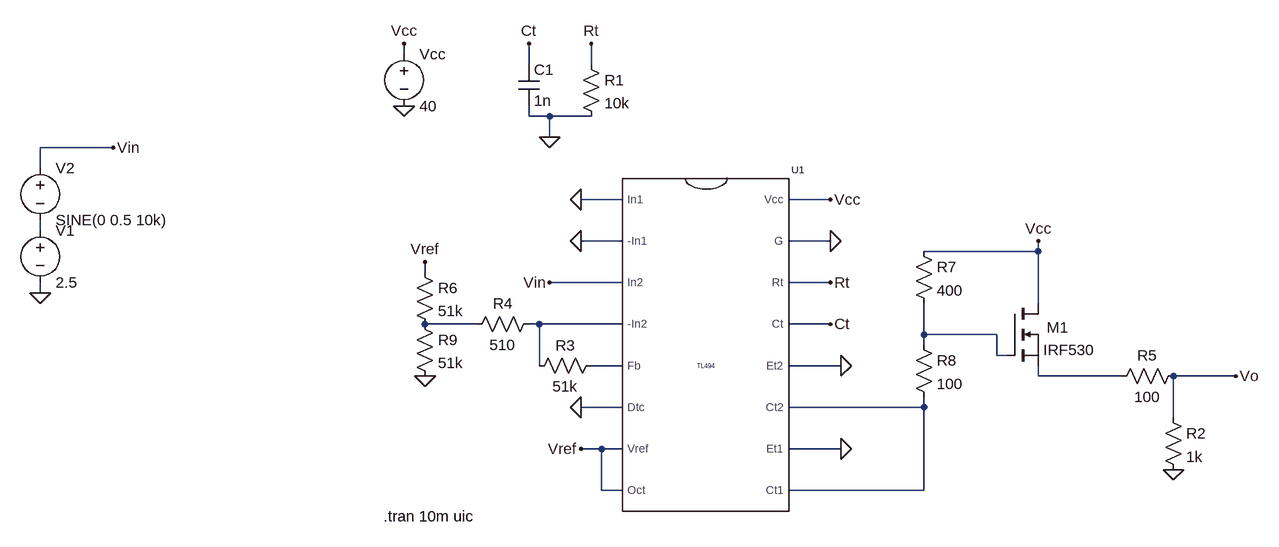
[diagram p0: schematic tl494 erik.asc]
tl494 erik.asc, the LTspice schematic file:
Version 4
SHEET 1 1120 680
WIRE -208 -240 -208 -256
WIRE -16 -224 -16 -256
WIRE 80 -224 80 -256
WIRE -16 -144 -16 -160
WIRE 16 -144 -16 -144
WIRE 80 -144 16 -144
WIRE 16 -112 16 -144
WIRE -656 -96 -768 -96
WIRE -768 -64 -768 -96
WIRE 128 -16 64 -16
WIRE 448 -16 384 -16
WIRE -768 32 -768 16
WIRE 128 48 64 48
WIRE 448 48 384 48
WIRE 768 64 768 48
WIRE 768 64 592 64
WIRE -176 96 -176 80
WIRE 128 112 16 112
WIRE 448 112 384 112
WIRE -768 128 -768 112
WIRE 768 144 768 64
WIRE -96 176 -176 176
WIRE 0 176 -16 176
WIRE 128 176 0 176
WIRE 448 176 384 176
WIRE 592 192 592 144
WIRE 704 192 592 192
WIRE 592 208 592 192
WIRE 704 224 704 192
WIRE 720 224 704 224
WIRE 0 240 0 176
WIRE 128 240 80 240
WIRE 464 240 384 240
WIRE 768 256 768 240
WIRE 896 256 768 256
WIRE 1072 256 976 256
WIRE 128 304 64 304
WIRE 592 304 592 288
WIRE 592 304 384 304
WIRE 976 320 976 256
WIRE 96 368 64 368
WIRE 128 368 96 368
WIRE 464 368 384 368
WIRE 96 432 96 368
WIRE 128 432 96 432
WIRE 592 432 592 304
WIRE 592 432 384 432
FLAG -208 -160 0
FLAG 448 -16 Vcc
FLAG 448 48 0
FLAG 16 -112 0
FLAG 448 112 Rt
FLAG 80 -256 Rt
FLAG -16 -256 Ct
FLAG 448 176 Ct
FLAG -208 -256 Vcc
FLAG 64 -16 0
FLAG 64 48 0
FLAG 64 304 0
FLAG 464 240 0
FLAG 464 368 0
FLAG 768 48 Vcc
FLAG 976 400 0
FLAG 1072 256 Vo
FLAG 64 368 Vref
FLAG -176 256 0
FLAG -176 80 Vref
FLAG 16 112 Vin
FLAG -768 128 0
FLAG -656 -96 Vin
SYMBOL tl494 256 240 R0
SYMATTR InstName U1
SYMBOL voltage -208 -256 R0
WINDOW 123 0 0 Left 0
WINDOW 39 0 0 Left 0
SYMATTR InstName Vcc
SYMATTR Value 40
SYMBOL cap -32 -224 R0
SYMATTR InstName C1
SYMATTR Value 1n
SYMBOL res 64 -240 R0
SYMATTR InstName R1
SYMATTR Value 10k
SYMBOL res 96 224 R90
WINDOW 0 0 56 VBottom 2
WINDOW 3 32 56 VTop 2
SYMATTR InstName R3
SYMATTR Value 51k
SYMBOL res 0 160 R90
WINDOW 0 0 56 VBottom 2
WINDOW 3 32 56 VTop 2
SYMATTR InstName R4
SYMATTR Value 510
SYMBOL res 992 240 R90
WINDOW 0 0 56 VBottom 2
WINDOW 3 32 56 VTop 2
SYMATTR InstName R5
SYMATTR Value 100
SYMBOL res 960 304 R0
SYMATTR InstName R2
SYMATTR Value 1k
SYMBOL res 576 48 R0
SYMATTR InstName R7
SYMATTR Value 400
SYMBOL res 576 192 R0
SYMATTR InstName R8
SYMATTR Value 100
SYMBOL nmos 720 144 R0
WINDOW 0 61 37 Left 2
SYMATTR InstName M1
SYMATTR Value IRF530
SYMBOL res -192 80 R0
SYMATTR InstName R6
SYMATTR Value 51k
SYMBOL res -192 160 R0
SYMATTR InstName R9
SYMATTR Value 51k
SYMBOL voltage -768 16 R0
WINDOW 123 0 0 Left 0
WINDOW 39 0 0 Left 0
SYMATTR InstName V1
SYMATTR Value 2.5
SYMBOL voltage -768 -80 R0
WINDOW 123 0 0 Left 0
WINDOW 39 0 0 Left 0
SYMATTR InstName V2
SYMATTR Value SINE(0 0.5 10k)
TEXT -240 472 Left 2 !.tran 10m uic

The netlist it stands for:
* tl494 erik.asc
XU1 0 0 Vin N003 N005 0 Vref Vref N007 0 N007 0 Ct Rt 0 Vcc TL494 TL494  ; pins In1 -In1 In2 -In2 Fb Dtc Vref Oct Ct1 Et1 Ct2 Et2 Ct Rt G Vcc
Vcc Vcc 0 40
C1 Ct 0 1n
R1 Rt 0 10k
R3 N005 N003 51k
R4 N003 N002 510
R5 Vo N006 100
R2 Vo 0 1k
R7 Vcc N004 400
R8 N004 N007 100
M1 Vcc N004 N006 N006 IRF530
R6 Vref N002 51k
R9 N002 0 51k
V1 N001 0 2.5
V2 Vin N001 SINE(0 0.5 10k)
.model NMOS NMOS
.model PMOS PMOS
.lib standard.mos
.tran 10m uic
.lib tl494.sub
.backanno
.end